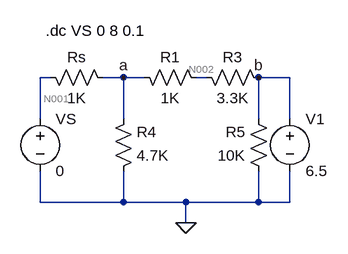
[diagram p0: schematic Draft1.asc]
Draft1.asc, the LTspice schematic file:
Version 4
SHEET 1 880 680
WIRE 96 80 80 80
WIRE 208 80 176 80
WIRE 240 80 208 80
WIRE 336 80 320 80
WIRE 464 80 416 80
WIRE 80 144 80 80
WIRE 208 144 208 80
WIRE 416 144 416 80
WIRE 464 144 464 80
WIRE 80 272 80 224
WIRE 208 272 208 224
WIRE 208 272 80 272
WIRE 304 272 208 272
WIRE 416 272 416 224
WIRE 416 272 304 272
WIRE 464 272 464 224
WIRE 464 272 416 272
WIRE 304 304 304 272
FLAG 208 80 a
FLAG 416 80 b
FLAG 304 304 0
SYMBOL res 80 64 M90
WINDOW 0 0 56 VBottom 2
WINDOW 3 32 56 VTop 2
SYMATTR InstName Rs
SYMATTR Value 1K
SYMBOL res 224 64 M90
WINDOW 0 0 56 VBottom 2
WINDOW 3 32 56 VTop 2
SYMATTR InstName R1
SYMATTR Value 1K
SYMBOL res 320 64 M90
WINDOW 0 0 56 VBottom 2
WINDOW 3 32 56 VTop 2
SYMATTR InstName R3
SYMATTR Value 3.3K
SYMBOL res 192 240 M180
WINDOW 0 36 76 Left 2
WINDOW 3 36 40 Left 2
SYMATTR InstName R4
SYMATTR Value 4.7K
SYMBOL res 432 240 R180
WINDOW 0 36 76 Left 2
WINDOW 3 36 40 Left 2
SYMATTR InstName R5
SYMATTR Value 10K
SYMBOL voltage 464 128 R0
SYMATTR InstName V1
SYMATTR Value 6.5
SYMBOL voltage 80 128 R0
SYMATTR InstName VS
SYMATTR Value 0
TEXT 88 8 Left 2 !.dc VS 0 8 0.1

The netlist it stands for:
* Draft1.asc
Rs N001 a 1K
R1 a N002 1K
R3 N002 b 3.3K
R4 0 a 4.7K
R5 0 b 10K
V1 b 0 6.5
VS N001 0 0
.dc VS 0 8 0.1
.backanno
.end

* Results of the author's LTspice run, read from the files saved beside the schematic
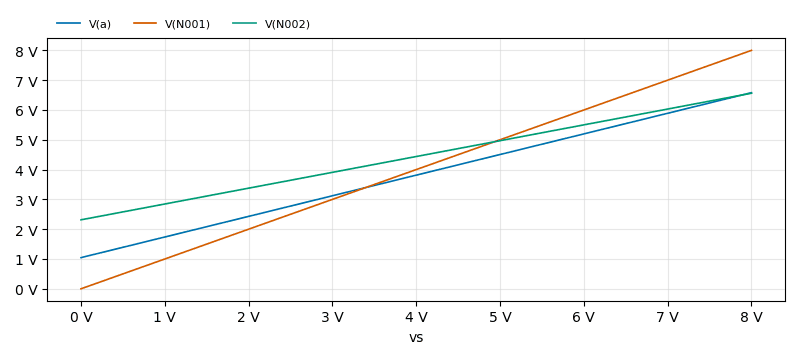
[diagram p1: DC transfer characteristic of Draft1.asc, plotted from the saved traces]
* DC transfer characteristic, 1 run:
*   V(a): 1.046 V at vs=0 V, 6.581 V at vs=8 V, min 1.046 V, max 6.581 V
*   V(N001): 0 V at vs=0 V, 8 V at vs=8 V, min 0 V, max 8 V
*   V(N002): 2.314 V at vs=0 V, 6.562 V at vs=8 V, min 2.314 V, max 6.562 V